# Altium schematic sheet 6_uart_esc_i2c.SchDoc: PWM/UART
size A3; SheetNumber: 6; SheetTotal: 8
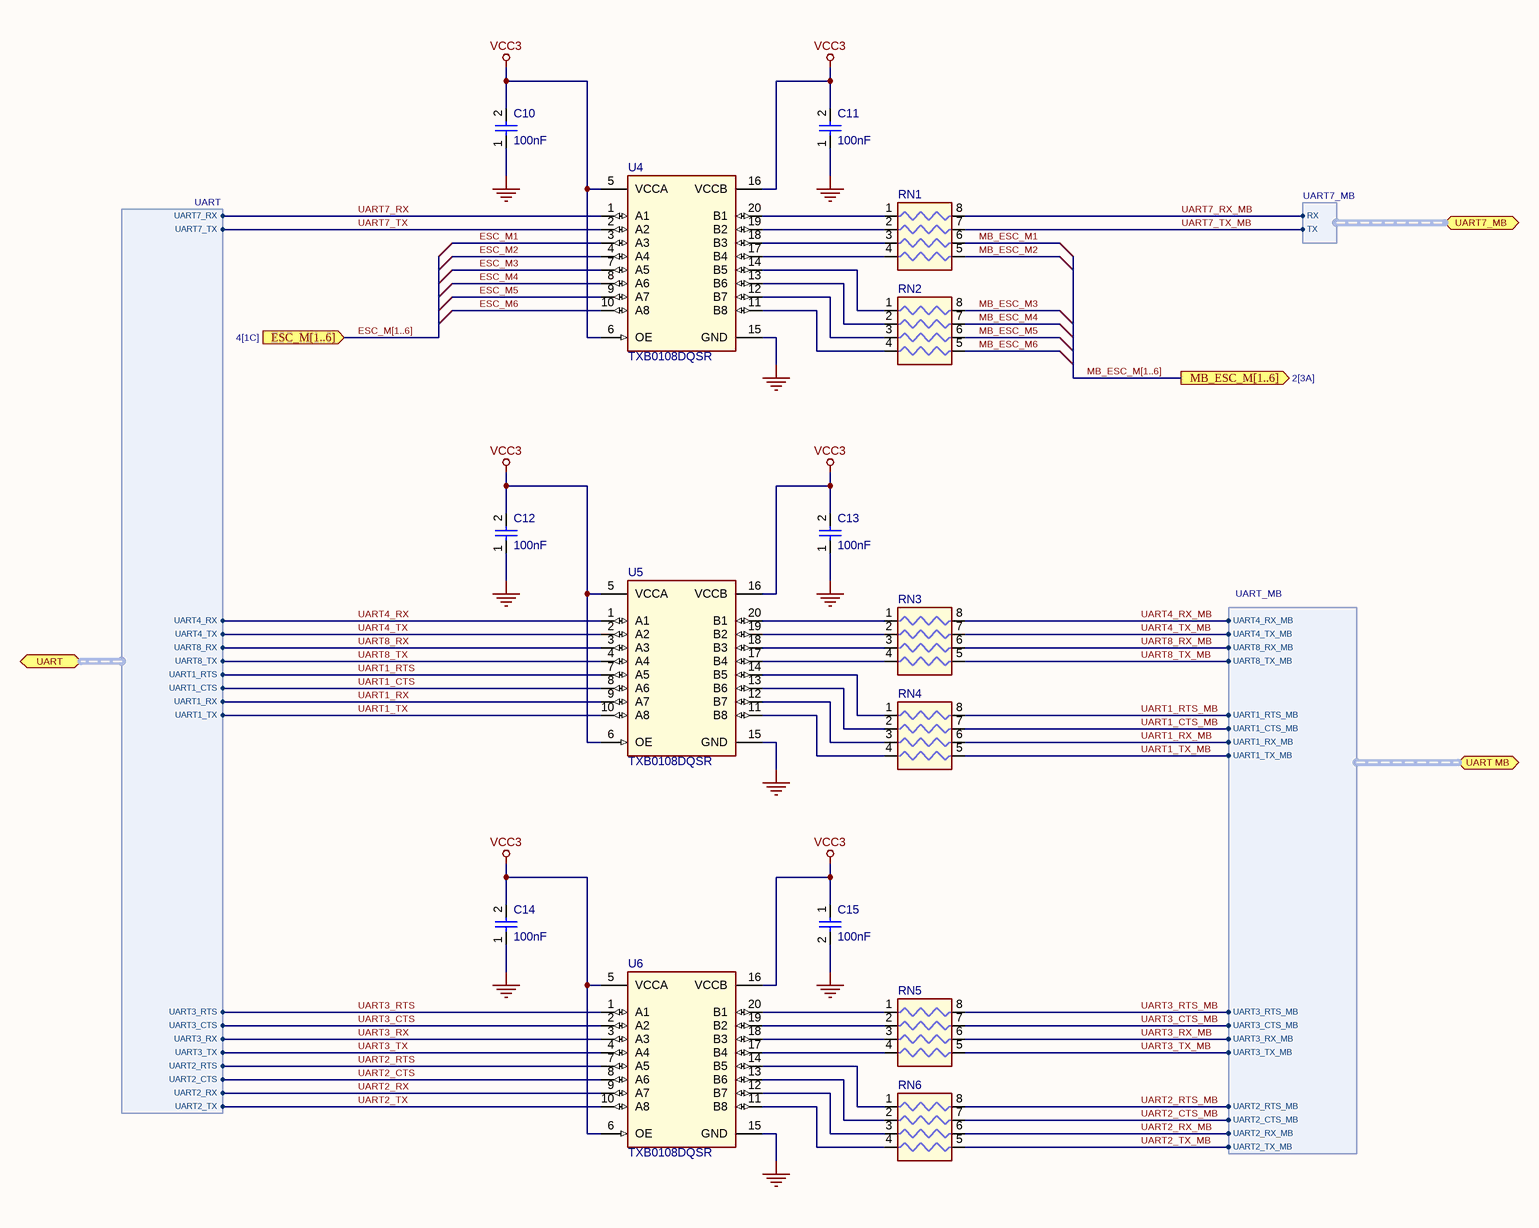
[diagram p0: 6_uart_esc_i2c.SchDoc]

## Parts
C10  value 100nF  [CAPC0402(1005)60_L]  (hidden comment: Capacitor 100nF +/-20% 10V 0402)
C11  value 100nF  [CAPC0402(1005)60_L]  (hidden comment: Capacitor 100nF +/-20% 10V 0402)
C12  value 100nF  [CAPC0402(1005)60_L]  (hidden comment: Capacitor 100nF +/-20% 10V 0402)
C13  value 100nF  [CAPC0402(1005)60_L]  (hidden comment: Capacitor 100nF +/-20% 10V 0402)
C14  value 100nF  [CAPC0402(1005)60_L]  (hidden comment: Capacitor 100nF +/-20% 10V 0402)
C15  value 100nF  [CAPC0402(1005)60_L]  (hidden comment: Capacitor 100nF +/-20% 10V 0402)
RN1  Resistor 200R +/-5% 0402 62.5 mW  [Panasonic_EXB28]  (value not drawn)
RN2  Resistor 200R +/-5% 0402 62.5 mW  [Panasonic_EXB28]  (value not drawn)
RN3  Resistor 200R +/-5% 0402 62.5 mW  [Panasonic_EXB28]  (value not drawn)
RN4  Resistor 200R +/-5% 0402 62.5 mW  [Panasonic_EXB28]  (value not drawn)
RN5  Resistor 200R +/-5% 0402 62.5 mW  [Panasonic_EXB28]  (value not drawn)
RN6  Resistor 200R +/-5% 0402 62.5 mW  [Panasonic_EXB28]  (value not drawn)
U4  TXB0108DQSR  [DQS0020A_V]
U5  TXB0108DQSR  [DQS0020A_V]
U6  TXB0108DQSR  [DQS0020A_V]

## Ports
ESC_M[1..6] (in, see 4[1C]), MB_ESC_M[1..6] (out, see 2[3A]), UART7_MB (bidir, harness UART7_MB), UART (bidir, harness UART), UART MB (bidir, harness UART_MB)

## Harnesses
UART7_MB: TX, RX
UART_MB: UART4_RX_MB, UART4_TX_MB, UART8_RX_MB, UART8_TX_MB, UART1_RTS_MB, UART1_CTS_MB, UART1_RX_MB, UART1_TX_MB, UART3_RTS_MB, UART3_CTS_MB, UART3_RX_MB, UART3_TX_MB, UART2_RTS_MB, UART2_CTS_MB, UART2_RX_MB, UART2_TX_MB
UART: UART7_RX, UART7_TX, UART4_RX, UART4_TX, UART8_RX, UART8_TX, UART1_RTS, UART1_CTS, UART1_RX, UART1_TX, UART3_RTS, UART3_CTS, UART3_RX, UART3_TX, UART2_RTS, UART2_CTS, UART2_RX, UART2_TX

## Nets
GND: C10.1 C11.1 C12.1 C13.1 C14.1 C15.2 U4.15(GND) U5.15(GND) U6.15(GND)
VCC3: C10.2 C11.2 C12.2 C13.2 C14.2 C15.1 U4.5(VCCA) U4.6(OE) U4.16(VCCB) U5.5(VCCA) U5.6(OE) U5.16(VCCB) U6.5(VCCA) U6.6(OE) U6.16(VCCB)
ESC_M1: U4.3(A3)
ESC_M2: U4.4(A4)
ESC_M3: U4.7(A5)
ESC_M4: U4.8(A6)
ESC_M5: U4.9(A7)
ESC_M6: U4.10(A8)
MB_ESC_M1: RN1.6
MB_ESC_M2: RN1.5
MB_ESC_M3: RN2.8
MB_ESC_M4: RN2.7
MB_ESC_M5: RN2.6
MB_ESC_M6: RN2.5
UART1_CTS: U5.8(A6) ; port UART.UART1_CTS
UART1_CTS_MB: RN4.7 ; port UART MB.UART1_CTS_MB
UART1_RTS: U5.7(A5) ; port UART.UART1_RTS
UART1_RTS_MB: RN4.8 ; port UART MB.UART1_RTS_MB
UART1_RX: U5.9(A7) ; port UART.UART1_RX
UART1_RX_MB: RN4.6 ; port UART MB.UART1_RX_MB
UART1_TX: U5.10(A8) ; port UART.UART1_TX
UART1_TX_MB: RN4.5 ; port UART MB.UART1_TX_MB
UART2_CTS: U6.8(A6) ; port UART.UART2_CTS
UART2_CTS_MB: RN6.7 ; port UART MB.UART2_CTS_MB
UART2_RTS: U6.7(A5) ; port UART.UART2_RTS
UART2_RTS_MB: RN6.8 ; port UART MB.UART2_RTS_MB
UART2_RX: U6.9(A7) ; port UART.UART2_RX
UART2_RX_MB: RN6.6 ; port UART MB.UART2_RX_MB
UART2_TX: U6.10(A8) ; port UART.UART2_TX
UART2_TX_MB: RN6.5 ; port UART MB.UART2_TX_MB
UART3_CTS: U6.2(A2) ; port UART.UART3_CTS
UART3_CTS_MB: RN5.7 ; port UART MB.UART3_CTS_MB
UART3_RTS: U6.1(A1) ; port UART.UART3_RTS
UART3_RTS_MB: RN5.8 ; port UART MB.UART3_RTS_MB
UART3_RX: U6.3(A3) ; port UART.UART3_RX
UART3_RX_MB: RN5.6 ; port UART MB.UART3_RX_MB
UART3_TX: U6.4(A4) ; port UART.UART3_TX
UART3_TX_MB: RN5.5 ; port UART MB.UART3_TX_MB
UART4_RX: U5.1(A1) ; port UART.UART4_RX
UART4_RX_MB: RN3.8 ; port UART MB.UART4_RX_MB
UART4_TX: U5.2(A2) ; port UART.UART4_TX
UART4_TX_MB: RN3.7 ; port UART MB.UART4_TX_MB
UART7_RX: U4.1(A1) ; port UART.UART7_RX
UART7_RX_MB: RN1.8 ; port UART7_MB.RX
UART7_TX: U4.2(A2) ; port UART.UART7_TX
UART7_TX_MB: RN1.7 ; port UART7_MB.TX
UART8_RX: U5.3(A3) ; port UART.UART8_RX
UART8_RX_MB: RN3.6 ; port UART MB.UART8_RX_MB
UART8_TX: U5.4(A4) ; port UART.UART8_TX
UART8_TX_MB: RN3.5 ; port UART MB.UART8_TX_MB
NetRN1_1: RN1.1 U4.20(B1)
NetRN1_2: RN1.2 U4.19(B2)
NetRN1_3: RN1.3 U4.18(B3)
NetRN1_4: RN1.4 U4.17(B4)
NetRN2_1: RN2.1 U4.14(B5)
NetRN2_2: RN2.2 U4.13(B6)
NetRN2_3: RN2.3 U4.12(B7)
NetRN2_4: RN2.4 U4.11(B8)
NetRN3_1: RN3.1 U5.20(B1)
NetRN3_2: RN3.2 U5.19(B2)
NetRN3_3: RN3.3 U5.18(B3)
NetRN3_4: RN3.4 U5.17(B4)
NetRN4_1: RN4.1 U5.14(B5)
NetRN4_2: RN4.2 U5.13(B6)
NetRN4_3: RN4.3 U5.12(B7)
NetRN4_4: RN4.4 U5.11(B8)
NetRN5_1: RN5.1 U6.20(B1)
NetRN5_2: RN5.2 U6.19(B2)
NetRN5_3: RN5.3 U6.18(B3)
NetRN5_4: RN5.4 U6.17(B4)
NetRN6_1: RN6.1 U6.14(B5)
NetRN6_2: RN6.2 U6.13(B6)
NetRN6_3: RN6.3 U6.12(B7)
NetRN6_4: RN6.4 U6.11(B8)

## Buses and harness runs
bus ESC_M[1..6] = port ESC_M[1..6]
bus MB_ESC_M[1..6] = port MB_ESC_M[1..6]

## Notes on the sheet
- Title
- Size:
- Date:
- A3
- Number:
- Time:
- Revision:
- Sheet
- of
- File:

## Library data of the parts
C10-C15 = CMP-001-00061-2: Chip Capacitor, 100nF +/-20%, 10V, 0402, Thickness 0.6 mm; Tolerance: 20%; Case/Package: 0402; Min Operating Temperature: -55°C; Mounting Technology: SMT; Max Operating Temperature: 85°C; Pins: 2; Voltage Rating: 10V
RN1-RN6 = CMP-009-00117-2: Res Thick Film Array 200 Ohm 5% 200ppm/C ISOL Molded 8-Pin 0804(4 X 0402) Convex SMD Punched Carrier T/R; Value: 200; Power: 62.5mW; Case/Package: 0402; Min Operating Temperature: -55°C; Tolerance: 5%; Max Operating Temperature: 125°C; Pins: 8
U4-U6 = CMP-015-00004-1: Bidirectional Voltage-Level Translator with Auto-Direction Sensing and +/-15 KV ESD Protection, 8 Bit, -40 to 85 degC, 20-Pin USON (DQS), Green (RoHS & no Sb/Br), Tape and Reel; Pins: 20